# EAGLE design led_driver_12v_1a_round (EAGLE 7.5.0)
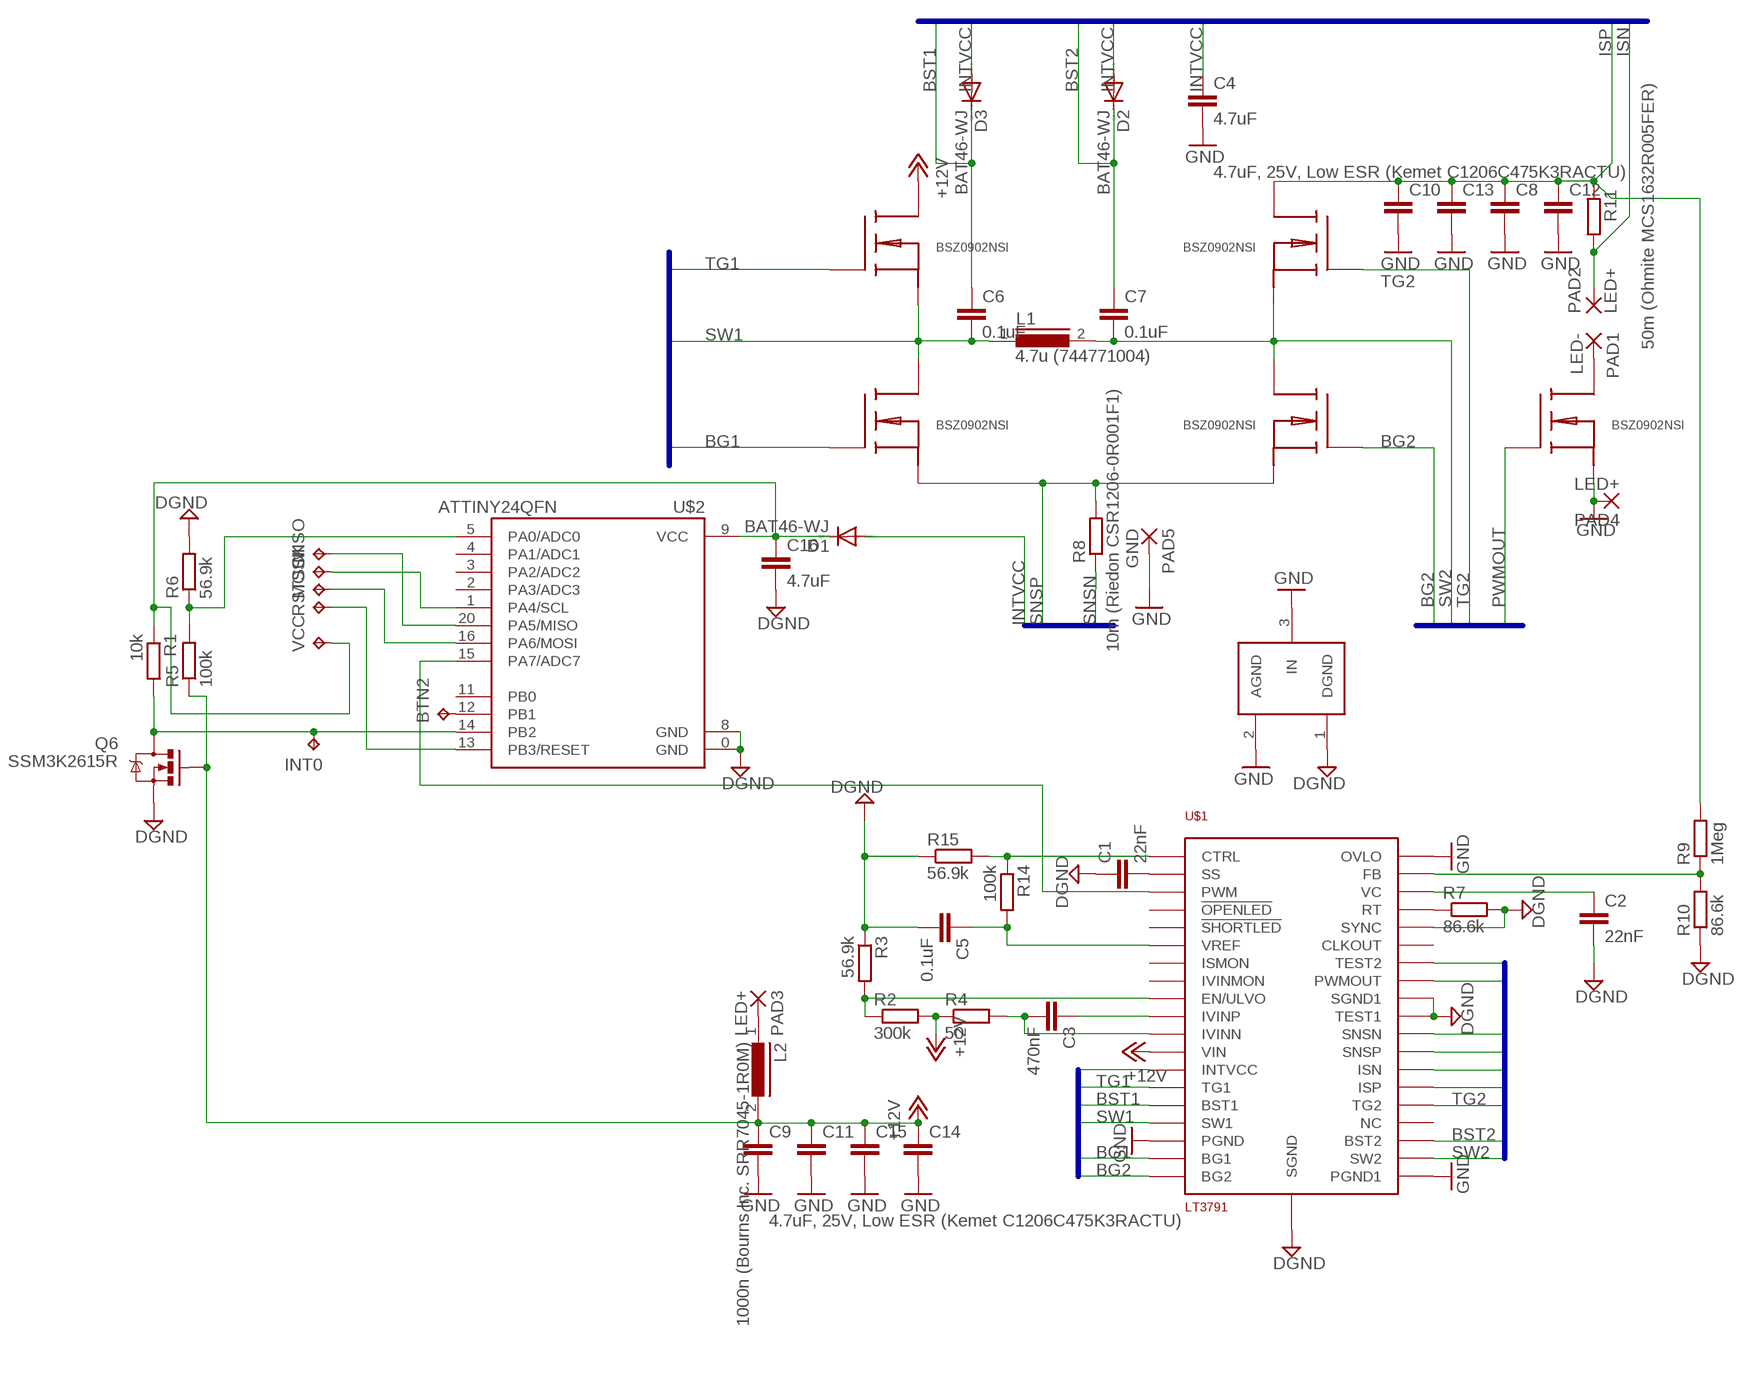
[diagram p0: schematic, sheet 1]

## Parts
BTN2  TPTP20SQ  [TP20SQ]
C1  22nF  C-EUC0402  [C0402]
C2  22nF  C-EUC0402K  [C0402K]
C3  470nF  C-EUC0402K  [C0402K]
C4  4.7uF  C-EUC1206  [C1206]
C5  0.1uF  C-EUC0402K  [C0402K]
C6  0.1uF  C-EUC0402K  [C0402K]
C7  0.1uF  C-EUC0402K  [C0402K]
C8  4.7uF, 25V, Low ESR (Kemet C1206C475K3RACTU)  C-EUC1206  [C1206]
C9  4.7uF, 25V, Low ESR (Kemet C1206C475K3RACTU)  C-EUC1206  [C1206]
C10  4.7uF, 25V, Low ESR (Kemet C1206C475K3RACTU)  C-EUC1206  [C1206]
C11  4.7uF, 25V, Low ESR (Kemet C1206C475K3RACTU)  C-EUC1206  [C1206]
C12  4.7uF, 25V, Low ESR (Kemet C1206C475K3RACTU)  C-EUC1206  [C1206]
C13  4.7uF, 25V, Low ESR (Kemet C1206C475K3RACTU)  C-EUC1206  [C1206]
C14  4.7uF, 25V, Low ESR (Kemet C1206C475K3RACTU)  C-EUC1206  [C1206]
C15  4.7uF, 25V, Low ESR (Kemet C1206C475K3RACTU)  C-EUC1206  [C1206]
C16  4.7uF  C-EUC1206  [C1206]
D1  BAT46-WJ  DIODE-SOD323-W  [SOD323-W]
D2  BAT46-WJ  DIODE-SOD323-W  [SOD323-W]
D3  BAT46-WJ  DIODE-SOD323-W  [SOD323-W]
INT0  TPTP20SQ  [TP20SQ]
L1  4.7u (744771004)  DR127  [DR127]
L2  1000n (Bourns Inc. SRR7045-1R0M)  DR74  [DR74]
MISO  TPTP11R  [TP11R]
MOSI  TPTP11R  [TP11R]
PAD1  LED-  WIREPADSMD5-2,5  [5-2,5]
PAD2  LED+  WIREPADSMD5-2,5  [5-2,5]
PAD3  LED+  WIREPADSMD5-2,5  [5-2,5]
PAD4  LED+  WIREPADSMD5-2,5  [5-2,5]
PAD5  GND  WIREPADSMD1,27-254  [SMD1,27-2,54]
Q1  BSZ0902NSI  BSZ090X  [BSZ090X]
Q2  BSZ0902NSI  BSZ090X  [BSZ090X]
Q3  BSZ0902NSI  BSZ090X  [BSZ090X]
Q4  BSZ0902NSI  BSZ090X  [BSZ090X]
Q5  BSZ0902NSI  BSZ090X  [BSZ090X]
Q6  SSM3K2615R  MOSFET-NCHANNELBSS123LT1G  [SOT23-3]
R1  10k  R-EU_R0402  [R0402]
R2  300k  R-EU_R0402  [R0402]
R3  56.9k  R-EU_R0402  [R0402]
R4  50  R-EU_R0402  [R0402]
R5  100k  R-EU_R0402  [R0402]
R6  56.9k  R-EU_R0402  [R0402]
R7  86.6k  R-EU_R0402  [R0402]
R8  10m (Riedon CSR1206-0R001F1)  R-EU_R1206  [R1206]
R9  1Meg  R-EU_R0402  [R0402]
R10  86.6k  R-EU_R0402  [R0402]
R11  50m (Ohmite MCS1632R005FER)  R-EU_R1206  [R1206]
R14  100k  R-EU_R0402  [R0402]
R15  56.9k  R-EU_R0402  [R0402]
RST  TPTP11R  [TP11R]
SCK  TPTP11R  [TP11R]
U$1  LT3791  [TSSOP38]
U$2  ATTINY24QFN  [QFN20]
U$4  GND_CONNECT  [GND_CONNECT]
VCC  TPTP11R  [TP11R]

## Nets
+12V: C9.1 C11.1 C14.1 C15.1 L2.2 Q1.D Q1.D@1(D) Q1.D@2(D) Q1.D@3(D) Q1.D@4(D) Q6.1(G) R2.2 R4.1 R5.1 U$1.P$12(VIN)
BG1 [HI_PWR]: Q2.G U$1.P$18(BG1)
BG2 [HI_PWR]: Q3.G U$1.P$19(BG2)
BST1 [HI_PWR]: C6.1 D3.C U$1.P$15(BST1)
BST2 [HI_PWR]: C7.1 D2.C U$1.P$22(BST2)
DGND: C1.1 C2.2 C5.2 C16.2 Q6.2(S) R3.1 R6.2 R7.2 R10.1 R15.1 U$1.P$29(TEST1) U$1.P$30(SGND) U$1.P$34(SYNC) U$1.P$39(SGND1) U$2.0(GND) U$2.8(GND) U$4.1(DGND)
GND [HI_PWR]: C4.2 C8.2 C9.2 C10.2 C11.2 C12.2 C13.2 C14.2 C15.2 PAD4.1(P) PAD5.1(P) Q5.S@1(S) Q5.S@2(S) Q5.S@3(S) Q5.S@4(S) U$1.P$17(PGND) U$1.P$20(PGND1) U$1.P$38(OVLO) U$4.2(AGND) U$4.3(IN)
INTVCC [HI_PWR]: C4.1 D1.A D2.A D3.A U$1.P$13(INTVCC) U$1.P$32(TEST2)
ISN: PAD2.1(P) R11.2 U$1.P$26(ISN)
ISP: C8.1 C10.1 C12.1 C13.1 Q4.D Q4.D@1(D) Q4.D@2(D) Q4.D@3(D) Q4.D@4(D) R9.2 R11.1 U$1.P$25(ISP)
N$1: C5.1 R14.2 U$1.P$6(VREF)
N$2: R14.1 R15.2 U$1.P$1(CTRL)
N$3: R7.1 U$1.P$35(RT)
N$4: C1.2 U$1.P$2(SS)
N$5: C2.1 U$1.P$36(VC)
N$6: R9.1 R10.2 U$1.P$37(FB)
N$7: C3.1 U$1.P$10(IVINP)
N$8: BTN2.TP U$2.12(PB1)
N$9: C3.2 R4.2 U$1.P$11(IVINN)
N$11: R2.1 R3.2 U$1.P$9(EN/ULVO)
N$12: C16.1 D1.C R1.1 U$2.9(VCC) VCC.TP
N$13: INT0.TP Q6.3(D) R1.2 U$2.14(PB2)
N$14: U$1.P$3(PWM) U$2.15(PA7/ADC7)
N$15: R5.2 R6.1 U$2.5(PA0/ADC0)
N$16: MISO.TP U$2.20(PA5/MISO)
N$17: MOSI.TP U$2.16(PA6/MOSI)
N$18: RST.TP U$2.13(PB3/RESET)
N$19: PAD1.1(P) Q5.D Q5.D@1(D) Q5.D@2(D) Q5.D@3(D) Q5.D@4(D)
N$20: SCK.TP U$2.1(PA4/SCL)
N$21: L2.1 PAD3.1(P)
PWMOUT [HI_PWR]: Q5.G U$1.P$31(PWMOUT)
SNSN: R8.1 U$1.P$28(SNSN)
SNSP: Q2.S@1(S) Q2.S@2(S) Q2.S@3(S) Q2.S@4(S) Q3.S@1(S) Q3.S@2(S) Q3.S@3(S) Q3.S@4(S) R8.2 U$1.P$27(SNSP)
SW1 [HI_PWR]: C6.2 L1.1 Q1.S@1(S) Q1.S@2(S) Q1.S@3(S) Q1.S@4(S) Q2.D Q2.D@1(D) Q2.D@2(D) Q2.D@3(D) Q2.D@4(D) U$1.P$16(SW1)
SW2 [HI_PWR]: C7.2 L1.2 Q3.D Q3.D@1(D) Q3.D@2(D) Q3.D@3(D) Q3.D@4(D) Q4.S@1(S) Q4.S@2(S) Q4.S@3(S) Q4.S@4(S) U$1.P$21(SW2)
TG1 [HI_PWR]: Q1.G U$1.P$14(TG1)
TG2 [HI_PWR]: Q4.G U$1.P$24(TG2)
Unconnected: U$1.P$4(!OPENLED) U$1.P$5(!SHORTLED) U$1.P$7(ISMON) U$1.P$8(IVINMON) U$1.P$23(NC) U$1.P$33(CLKOUT) U$2.2(PA3/ADC3) U$2.3(PA2/ADC2) U$2.4(PA1/ADC1) U$2.11(PB0)

## Buses
BG1,BG2,SW1,SW2,TG1,TG2,BST1,BST2,INTVCC
BG1,BG2,SW1,SW2,TG1,TG2,BST1,BST2,INTVCC,PWMOUT,SNSP,SNSN,ISN,ISP

## Library data of the parts
BTN2 INT0 MISO MOSI RST SCK VCC = testpad:TP: Test pad
C1-C3 C5-C7 = resistor:C-EU: CAPACITOR, European symbol
C4 C8-C16 = rcl:C-EU: CAPACITOR, European symbol
D1-D3 = diode:DIODE-: DIODE
L1 = inductors:DR127: High Power Density, High Efficiency, Shielded Inductors Source: coiltronics_dr_series.pdf
L2 = inductors:DR74: High Power Density, High Efficiency, Shielded Inductors Source: coiltronics_dr_series.pdf
PAD1-PAD5 = wirepad:WIREPAD: Wire PAD connect wire on PCB
Q1-Q5 = vsd_custom:BSZ090X
Q6 = SparkFun-DiscreteSemi:MOSFET-NCHANNEL: Common NMOSFET Parts MFG P/N Store ID Prod ID FDD8780 TRANS-09984 SI7820DN TRANS-11055 FDS6630A IC-08089 2N7002PW TRANS-11151 FQP30N06L COM-10213 TRANS-10060 BSS123LT1G TRANS-08345 BSS138 TRANS-00830 BS170 2N7000; PROD_ID: TRANS-08345
R1-R11 R14 R15 = resistor:R-EU_: RESISTOR, European symbol
U$1 = ltc3791:LT3791
U$2 = SparkFun-DigitalIC:ATTINY24: Atmel 20-pin 2kB flash uC
U$4 = SparkFun-Passives:GND_CONNECT: Use to make a connection of multiple grounds in only one place.

## Net classes
0 default: width 0.152 mm, clearance 0.152 mm
1 HI_PWR: width 0.3 mm, drill 0.4 mm, clearance 0.15 mm

## Board
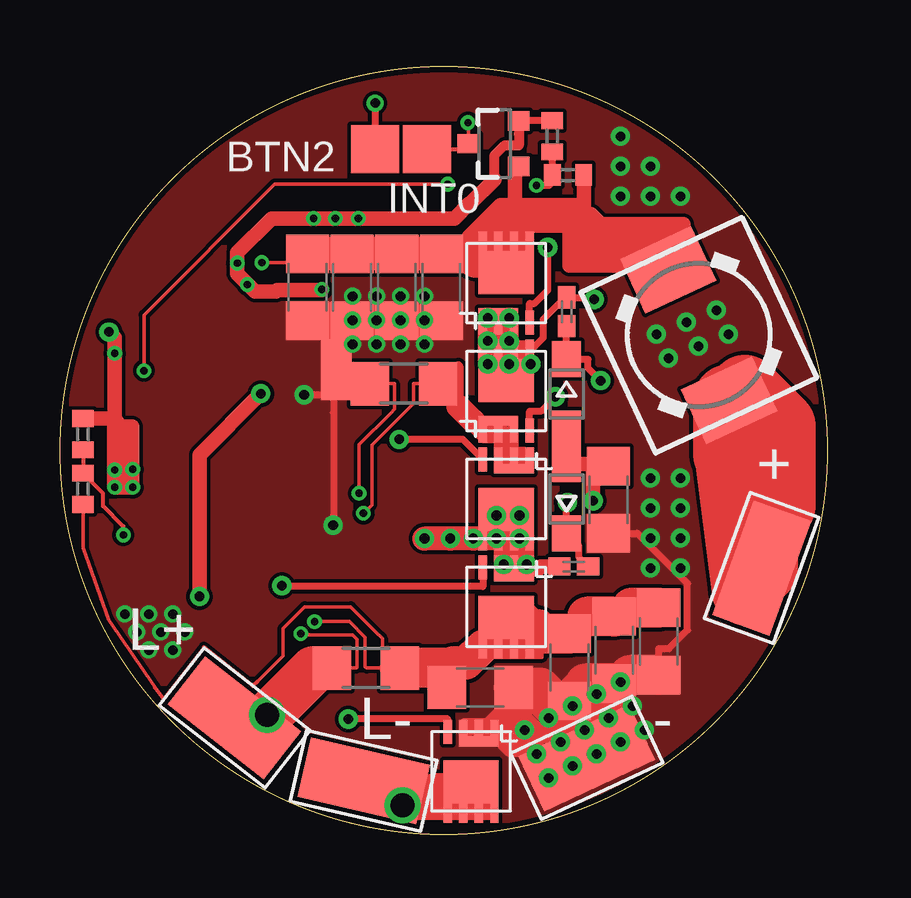
[diagram p1: board, top side]
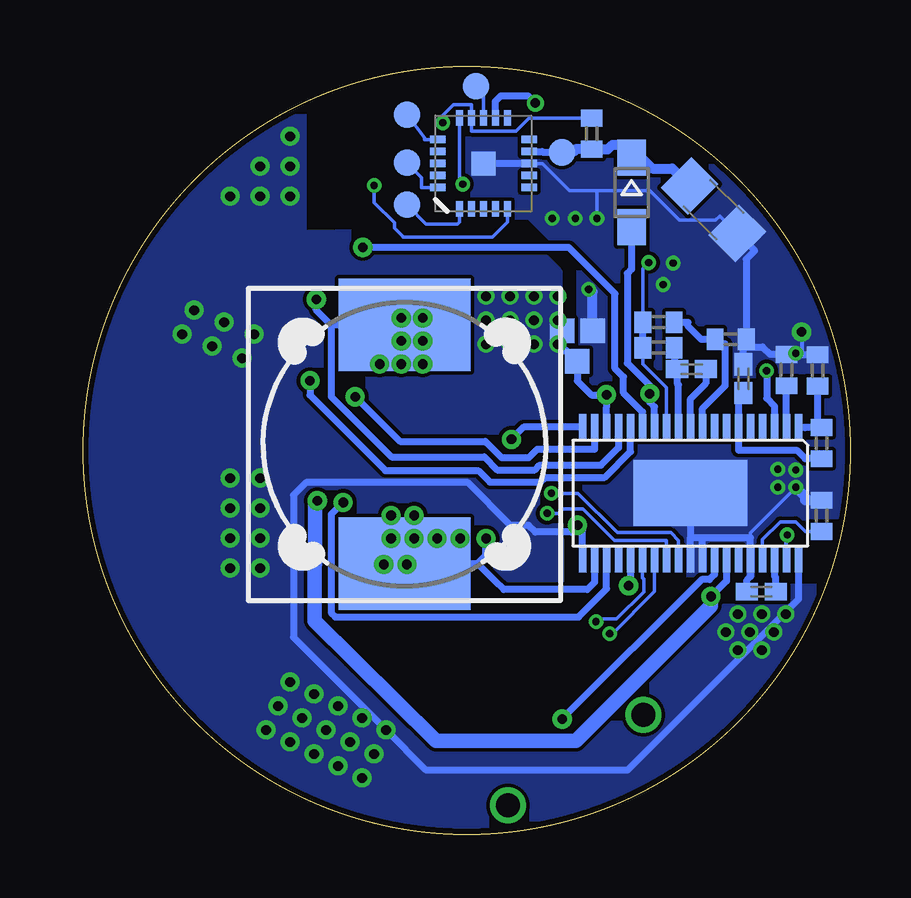
[diagram p2: board, bottom side, seen from below]

Size 32 x 32 mm. Coordinates in mm from the lower left corner, seen from the top.
Outline: circle at 16,16 radius 16
Copper layers (1*16): Top 0.035mm / dielectric 1.5mm / Bottom 0.035mm
Design rules "SeeedStudio_2layer_DRU_no_angle_20140221": minimum track width 6mil, minimum drill 12mil, track to track 6mil, track to pad 6mil, pad to pad 6mil, via to via 6mil, smd to smd 0mil, copper to edge 10mil, drill to drill 10mil, minimum pad ring 10mil, minimum via ring 6mil, stop-mask expansion 2mil, vias tented up to drill 100mil, thermal gap 10mil

### Footprints (pad centres in the part's own frame; a part is rotated, then mirrored left to right if it is on the bottom)
TP20SQ = smd 2 x 2: TP 0,0
C0402 = smd 0.7 x 0.9: 1 -0.65,0; 2 0.65,0
C0402K = smd 0.925 x 0.74: 1 -0.6,0; 2 0.6,0
C1206 = smd 1.6 x 1.8: 1 -1.4,0; 2 1.4,0
SOD323-W = smd 1.5 x 1.2: A 1.45,0; C -1.45,0
DR127 = smd 3.85 x 5.5: 1 -4.975,0; 2 4.975,0
DR74 = smd 2.5 x 3.25: 1 -3,0; 2 3,0
TP11R = smd 1.1 x 1.1: TP 0,0
5-2,5 = smd 2.54 x 5.08: 1 0,0
SMD1,27-2,54 = smd 1.27 x 2.54: 1 0,0
BSZ090X = smd 1.8 x 2.3: D 0.44,0 | smd 1 x 0.35: D@1 1.65,-0.975; D@2 1.65,-0.325; D@3 1.65,0.325; D@4 1.65,0.975; G -1.65,-0.975; S@2 -1.65,-0.325; S@3 -1.65,0.325; S@4 -1.65,0.975 | smd 0.4 x 1.65: S@1 -1.25,0.325
SOT23-3 = smd 0.8 x 0.9: 1 -0.95,-1; 2 0.95,-1; 3 0,1.1
R0402 = smd 0.7 x 0.9: 1 -0.65,0; 2 0.65,0
R1206 = smd 1.6 x 1.803: 1 -1.422,0; 2 1.422,0
TSSOP38 = smd 1.1 x 0.315: P$1 -2.75,4.5; P$2 -2.75,4; P$3 -2.75,3.5; P$4 -2.75,3; P$5 -2.75,2.5; P$6 -2.75,2; P$7 -2.75,1.5; P$8 -2.75,1; P$9 -2.75,0.5; P$10 -2.75,0; P$11 -2.75,-0.5; P$12 -2.75,-1; P$13 -2.75,-1.5; P$14 -2.75,-2; P$15 -2.75,-2.5; P$16 -2.75,-3; P$17 -2.75,-3.5; P$18 -2.75,-4; P$19 -2.75,-4.5; P$20 2.75,-4.5; P$21 2.75,-4; P$22 2.75,-3.5; P$23 2.75,-3; P$24 2.75,-2.5; P$25 2.75,-2; P$26 2.75,-1.5; P$27 2.75,-1; P$28 2.75,-0.5; P$29 2.75,0; P$30 2.75,0.5; P$31 2.75,1; P$32 2.75,1.5; P$33 2.75,2; P$34 2.75,2.5; P$35 2.75,3; P$36 2.75,3.5; P$37 2.75,4; P$38 2.75,4.5 | smd 2.75 x 4.75: P$39 0,0
QFN20 = smd 1 x 1: 0 0,0 | smd 0.65 x 0.3: 1 -1.9,1; 2 -1.9,0.5; 3 -1.9,0; 4 -1.9,-0.5; 5 -1.9,-1; 11 1.9,-1; 12 1.9,-0.5; 13 1.9,0; 14 1.9,0.5; 15 1.9,1 | smd 0.3 x 0.65: 6 -1,-1.9; 7 -0.5,-1.9; 8 0,-1.9; 9 0.5,-1.9; 10 1,-1.9; 16 1,1.9; 17 0.5,1.9; 18 0,1.9; 19 -0.5,1.9; 20 -1,1.9
GND_CONNECT = smd 1.016 x 1.016: 1 -1.016,0; 2 -1.016,-1.27; 3 0.254,-0.635

### Placement (x,y rotation side)
BTN2  13.14,28.56 90 top
C1  2.67,19.35 270 bottom
C2  3.72,10.12 180 bottom
C3  6.63,19.39 180 bottom
C4  22.87,13.95 270 top
C5  4.47,19 90 bottom
C6  21.12,21.78 90 top
C7  21.42,11.16 180 top
C8  21.24,6.96 270 top
C9  10.32,22.8 270 top
C10  24.96,8.04 270 top
C11  12.18,22.8 270 top
C12  17.52,6.12 0 top
C13  23.1,7.68 270 top
C14  15.9,22.8 270 top
C15  14.04,22.8 270 top
C16  5.71,26.04 315 bottom
D1  9.13,26.75 270 bottom
D2  21.12,13.98 90 top
D3  21.12,18.36 270 top
INT0  15.3,28.56 0 top
L1  18.6,16.26 270 bottom
L2  26.63,20.81 115 top
MISO  18.5,28 270 bottom
MOSI  18.5,30 270 bottom
PAD1  12.66,2.23 77 top
PAD2  7.28,4.86 52 top
PAD3  29.26,11.1 160 top
PAD4  21.96,3.18 115 top
PAD5  11.52,19.38 0 top
Q1  18.6,22.98 90 top
Q2  18.6,18.48 90 top
Q3  18.6,13.98 270 top
Q4  18.6,9.48 270 top
Q5  17.14,2.62 270 top
Q6  18.13,28.79 90 top
R1  10.79,29.2 90 bottom
R2  8.01,21.35 180 bottom
R3  5,20.63 180 bottom
R4  8.01,20.29 0 bottom
R5  21.18,27.48 180 top
R6  20.52,29.1 90 top
R7  1.21,13.28 90 bottom
R8  14.34,18.78 0 top
R9  0.96,14.4 270 top
R10  0.96,16.68 270 top
R11  12.75,6.93 180 top
R14  1.21,16.3 270 bottom
R15  1.38,19.34 270 bottom
RST  15.61,31.18 270 bottom
SCK  18.5,26.25 270 bottom
U$1  6.67,14.22 270 bottom
U$2  15.3,27.96 90 bottom
U$4  10.76,19.96 270 bottom
VCC  12.04,28.43 270 bottom

### Tracks (layer width: path | path; a pad name or v marks a point on that pad's centre or on a via)
+12V  (via drill 0.3 pad 0.61)
  Top 0.152: 15.17,24.2 C14.1 | 18.27,24.27 18.27,23.9 18.27,23.75 Q1.D | Q1.D@3 18.27,24.27 | 17.62,24.27 17.62,23.9 | Q1.D@4 17.62,24.27 | 17.62,24.27 18.27,24.27 | 10.32,23.69 10.54,23.69 11.05,24.2 | 10.32,23.69 10.26,23.83 v8.41,23.83 | C9.1 10.32,23.69
  Top 0.3: Q1.D@2 Q1.D@1
  Top 0.6: Q6.1 18.96,27.6 18.96,26.16 18.6,25.8 18.6,25.2 18.66,25.26 18.66,25.86 17.76,24.96 17.1,24.96 18.36,26.22 18.93,26.22 | 18.93,26.22 Q1.D@2 19.26,24.63 19.26,24.54 17.04,24.54 17.04,24.9 19.32,24.9 19.32,25.38 21.96,25.38 21.96,25.2 21.78,24.12 21.24,25.2 21.24,23.7 25.98,23.7 25.98,25.44 22.56,25.44 22.14,25.86 22.14,24.72 22.86,24 22.86,24.9 22.98,25.02 23.04,25.02 23.76,24.3 24.24,24.3 23.28,25.02 25.62,25.08 22.26,24.18 22.2,25.44 19.74,25.44 Q1.D@3 | R5.1 21.84,26.81 21.84,25.62 | 21.84,25.62 21.6,26.22 19.38,26.22 19.38,25.74 21.66,25.74 21.66,26.22 18.93,26.22 | 21.84,25.62 23.93,23.53 L2.2
  Top 1.4: C14.1 16.79,24.2 17.33,23.9 17.62,23.9 | 15.17,24.2 C15.1 C11.1 11.05,24.2
  Bottom 0.152: R4.1 8.65,19.61 7.67,18.63 7.67,17.75 U$1.P$12 | v8.41,23.83 8.65,23.59 R2.2
  Bottom 0.3: R4.1 R2.2
BG1  (via drill 0.4 pad 0.8)
  Top 0.3: v20.65,18.24 20.05,17.63 19.57,17.63 Q2.G
  Bottom 0.3: v20.65,18.24 20.64,18.24 18.78,16.38 15.24,16.38 15.18,16.32 15.16,16.32 14.55,15.7 13.41,15.7 13.05,16.06 10.68,16.06 U$1.P$18
BG2  (via drill 0.4 pad 0.8)
  Top 0.3: Q3.G 16.79,16.46 v14.14,16.46
  Bottom 0.3: U$1.P$19 13.63,16.97 v14.14,16.46
BST1  (via drill 0.4 pad 0.8)
  Top 0.3: v22.54,18.91 22.02,19.43 22.02,19.81 D3.C 21.12,20.86 C6.1
  Bottom 0.3: v22.54,18.91 22.54,18.31 19.39,15.16 15.52,15.16 15.04,14.68 12.92,14.68 12.72,14.88 10.25,14.88 9.18,15.95 U$1.P$15
BST2  (via drill 0.4 pad 0.8)
  Top 0.3: v21.16,13.83 21.16,13.62 21.12,13.58 D2.C 21.62,12.03 21.62,11.56 C7.1
  Bottom 0.3: v21.16,13.83 21.65,13.34 21.65,9.23 21.48,9.06 11.35,9.06 10.18,10.23 U$1.P$22
DGND  (via drill 0.3 pad 0.61, 0.4 pad 0.8)
  Top 0.152: v10.92,22.72 10.9,22.7
  Top 0.16: 2.27,17.33 2.28,17.34 | 8.81,25.67 8.83,25.67
  Top 0.3: R6.2 Q6.2
  Top 0.406: 9.06,22.68 9,22.62 | 8.13,22.62 8.12,22.64 | 18.12,27.3 18.12,28.32 18.54,28.72 19.13,28.72 19.13,29.2 Q6.2
  Top 0.6: 10.9,22.7 10.86,22.68 9.06,22.68 | 9,22.62 8.13,22.62 | 8.83,25.67 v10.57,25.67 16.45,25.67 17.06,26.28 17.1,26.28 18.12,27.3 | 8.12,22.64 7.39,23.36 7.39,24.25 8.81,25.67 | v2.28,14.46 2.96,14.46 3,14.5 3,17 2.5,17 | 2.5,17 2.25,17.25 2.25,14.5 2.5,14.5 2.75,14.75 2.75,16.75 2.5,17 | 2.5,17 2.28,17.34 2.28,20.7 v2.04,20.94 | R10.1 2.27,17.33
  Bottom 0.152: 4.17,12.37 4.17,12.57 v2.28,14.46 | 10.57,26.82 v10.57,25.67 | 10.57,26.82 11.71,26.82 12.85,27.96 U$2.8 | 10.57,26.82 | 10.57,26.82 8.38,26.82 7.15,25.6 5.63,25.6 5.45,25.78 C16.2 4.71,25.03 | R3.1 4.35,20.32 4.38,20.29 4.47,20.29 | 6.17,11.53 U$1.P$30
  Bottom 0.16: v2.04,20.94 2.04,20.12 2.16,20
  Bottom 0.3: 6.17,12.37 4.17,12.37 U$1.P$34 4.17,10.74 4.32,10.59 C2.2 | 6.67,12.37 6.17,12.37 | U$1.P$39 6.67,12.37 | C5.2 4.47,20.29 | 4.35,20.32 3.67,20.32 3.35,20 C1.1 2.16,20 2,20 1.98,19.98 R15.1 | 4.71,25.03 4,24.32 4.35,23.97 R3.1 | 6.17,11.53 6.17,12.37 | U$1.P$29 6.67,12.37 | U$2.8 U$2.0
  Bottom 0.406: R7.2 1.89,13.93 1.89,14.07 v2.28,14.46 | U$4.1 10.76,22.61 v10.92,22.72
  other vias: 7.39,23.81 11.47,25.67 12.43,25.67 7.81,22.91 2.28,15.19 2.28,20.05 3.03,14.47 3.03,15.22
  pour Bottom (no thermals): 0.12,10.86 11.4,10.86 11.34,10.92 11.34,17.94 11.28,18 11.28,23.64 13.38,25.74 21.72,25.74 21.72,35.4 10.84,35.4 0.84,25.4 0.84,24.66 0.12,23.94
GND  (via drill 0.4 pad 0.41, 0.4 pad 0.8)
  Top 0.3: v11.38,12.88 11.4,12.89 11.4,17.57 11.4,18.31 | 21.9,6.22 21.9,6.28 | 20.86,5.54 21.22,5.54 C8.2 | C13.2 23.4,6.28 23.76,6.64 | C4.2 24.07,12.54 26.16,10.45 26.16,8.51 25.39,7.74 24.96,7.74 C10.2 | 18.92,4.92 v19.37,4.35 | Q5.S@2 16.82,4.62 17.04,4.39 17.04,4.08 17.28,3.84 18.24,3.84 18.72,3.36 19.14,3.36 19.98,3.36 20.58,3.96 20.58,4.32 19.74,5.16 18.24,5.16 17.76,4.68 16.8,4.68 18.9,4.68 19.14,4.92 19.56,4.92 20.34,4.14 19.86,3.66 18.72,3.66 18.36,4.02 17.52,4.02 17.16,4.38 17.16,4.5 19.2,4.5 19.38,4.68 19.44,4.68 19.98,4.14 19.92,4.14 19.68,3.9 18.72,3.9 18.36,4.26 17.64,4.26 19.2,4.26 19.38,4.44 19.38,4.38 19.62,4.14 18.72,4.14 17.46,4.62 Q5.S@3 | 18.11,4.67 18.36,4.92 18.92,4.92 | Q5.S@3 Q5.S@1 Q5.S@3 | Q5.S@3 17.45,4.67 18.11,4.67 | C9.2 10.56,22.04 11.27,22.04 11.4,19.93 | 11.4,19.93 11.4,20.71 11.49,20.71 C11.2 12.84,21.4 | 11.4,19.93 PAD5.1 11.4,19.05 11.4,18.31 | C12.2 18.92,4.92 | 20.86,5.54 20.6,5.54 | 20.86,5.54 | Q5.S@4 18.11,4.67 | 11.4,18.31 v10.18,18.31 v10.18,18.32
  Top 1.4: 12.84,21.4 C15.2 C14.2
  Top 1.676: C8.2 21.9,6.22 | C13.2 21.9,6.28 | C10.2 23.76,6.64 | C12.2 20.02,6.12 20.6,5.54 | PAD4.1 21.06,3.18 21.06,4.26 23.16,4.26 23.16,5.7 20.86,5.54
  Bottom 0.3: U$1.P$38 2.17,9.8 9.3,2.67 17.69,2.67 v19.37,4.35 23.23,8.21 23.23,14.14 22.71,14.66 15.96,14.66 14.18,12.88 13.42,12.88 13.14,12.6 11.64,12.6 11.4,12.84 v11.38,12.88 11.18,12.67 11.18,11.89 U$1.P$20 | U$1.P$17 10.18,17.82 v10.18,18.32 10.8,18.32 11.39,18.9 U$4.3 11.85,20.17 12.03,20.17 U$4.2
  other vias: 2.7,9.18 3.7,9.18 4.7,9.18 3.2,8.43 4.2,8.43 5.2,8.43 3.7,7.68 4.7,7.68 12.2,20.43 13.2,20.43 14.2,20.43 15.2,20.43 15.2,21.43 14.2,21.43 13.2,21.43 12.2,21.43 12.2,22.43 13.2,22.43 14.2,22.43 15.2,22.43 19.87,3.35 20.37,2.35 21.37,2.85 20.87,3.85 20.37,4.85 21.37,5.35 21.87,4.35 22.37,3.35 23.37,3.85 22.87,4.85 22.37,5.85 23.37,6.35 23.87,5.35 24.37,4.35 23.37,29.1 23.37,27.85 23.37,26.6 24.62,27.85 24.62,26.6 25.87,26.6 24.62,11.1 24.62,12.35 24.62,13.6 24.62,14.85 25.87,14.85 25.87,13.6 25.87,12.35 25.87,11.1 24.87,20.85 26.12,21.35 27.37,21.85 27.87,20.85 26.62,20.35 25.37,19.85
  pour Bottom (no thermals): 0.3,10.14 12.24,10.14 12.3,23.4 13.92,25.02 22.98,24.9 22.98,30.18 24.84,30.66 28.26,30.9 34.26,10.44 23.34,-0.48 8.94,-0.48 0.3,8.16
  pour Top (no thermals): -0.42,33.6 32.28,33.6 32.28,-1.44 -0.42,-1.44
INTVCC  (via drill 0.4 pad 0.8)
  Top 0.3: 22.02,15.43 22.11,15.35 22.23,15.35 22.27,15.35 C4.1 | D3.A 21.12,15.86 21.14,15.86 21.57,15.43 D2.A
  Top 0.6: v22.23,13.9 22.23,15.35 | v5.82,9.91 5.82,15.82 v8.37,18.37 | 21.57,15.43 22.02,15.43
  Bottom 0.3: U$1.P$32 5.17,10.56 v5.82,9.91 | U$1.P$13 8.18,17.82 8.37,18.02 v8.37,18.37 8.37,18.7 9.31,19.64 9.31,23.38 9.13,23.56 9.13,25.25 D1.A
  Bottom 0.6: v5.82,9.91 5.82,9.53 11.45,3.9 17.28,3.9 22.35,8.9 22.32,13.44 22.32,13.81 v22.23,13.9
ISN  (via drill 0.3 pad 0.61, 1)
  Top 0.152: R11.2 12.36,6.93 12.39,6.97 12.39,8.12 12.2,8.31 10.09,8.31 v10.04,8.36
  Top 0.406: v8.64,4.98 8.54,4.98 7.95,4.38
  Top 1: R11.2 10.65,6.93 10.56,6.84
  Top 2: PAD2.1 7.95,4.38 8.04,4.32 10.56,6.84
  Bottom 0.152: v10.04,8.36 9.94,8.36 8.18,10.12 8.18,10.69 U$1.P$26 | v10.04,8.36
ISP  (via drill 0.3 pad 0.61)
  Top 0.152: v10.61,8.87 12.08,8.87 12.73,8.21 12.73,6.99 12.78,6.93 R11.1 | Q4.D 19.09,9.04 | 19.91,8.56 19.57,8.56 Q4.D@4 Q4.D@3 Q4.D@2 18.27,8.16 20.1,8.16 20.1,7.38 18.06,7.38 18.06,7.5 19.98,7.5 19.98,8.04 18.42,8.04 18.42,7.62 19.8,7.62 19.8,7.92 18.48,7.92 18.48,7.74 19.44,7.74 Q4.D@1 | C8.1 21.25,8.36 21.97,9.08 | C13.1 23.47,9.08 23.83,9.44 | C12.1 16.12,6.93 16.26,6.93 16.38,7.05 16.38,7.14 16.02,7.5 13.5,7.5 13.44,7.56 13.44,8.16 13.32,8.28 13.26,8.34 12.12,9.48 10.2,9.48 9.3,8.58 9.3,7.44 8.22,6.36 | R9.2 0.96,11.94 2.04,8.94 3.96,6.12
  Top 0.16: 8.22,6.36 8.04,6.18 6,7.8 4.32,5.64 3.96,6.12
  Top 1.4: Q4.D@1 16.93,7.14 16.38,7.14
  Top 1.676: 19.09,9.04 19.57,8.56 | C8.1 20.11,8.36 19.91,8.56 | C13.1 21.97,9.08 | 16.12,6.93 R11.1 | C10.1 23.83,9.44
  Bottom 0.152: v10.61,8.87 10.51,8.97 9.76,8.97 8.62,10.11 8.62,10.64 8.68,10.69 U$1.P$25
N$1
  Bottom 0.152: C5.1 4.67,18.19
  Bottom 0.3: R14.2 1.89,15.65 2.25,16.01 4.67,16.01 U$1.P$6 4.67,18.19
N$2
  Bottom 0.152: R14.1 1.38,16.95
  Bottom 0.3: R15.2 1.38,16.95 1.89,16.95 1.9,16.97 U$1.P$1
N$3
  Bottom 0.152: R7.1 1.89,12.62 2.29,13.02 2.93,13.02 3.67,12.28 3.67,12.25 U$1.P$35
N$4
  Bottom 0.3: U$1.P$2 C1.2
N$5
  Bottom 0.3: C2.1 3.12,10.71 3.17,10.77 U$1.P$36
N$6  (via drill 0.3)
  Top 0.16: R10.2 R9.1 1.8,14.21 1.8,13.68 2.64,12.84 v2.64,12.48
  Bottom 0.16: U$1.P$37 2.67,12.45 v2.64,12.48
N$7
  Bottom 0.3: C3.1 6.04,18.79 6.67,18.15 U$1.P$10
N$8  (via drill 0.4)
  Top 0.3: v13.14,30.48 BTN2.TP
  Bottom 0.3: U$2.12 14.8,30.55 14.58,30.78 13.44,30.78 v13.14,30.48
N$9
  Bottom 0.152: 7.36,19.61 7.24,19.49 C3.2
  Bottom 0.3: C3.2 7.24,18.79 7.17,18.73 U$1.P$11 | R4.2 7.36,19.61
N$11
  Bottom 0.3: U$1.P$9 6.17,17.75 5.22,18.7 5.22,20.44 R3.2 6.23,20.63 6.78,21.18 6.78,21.35 R2.1
N$12
  Bottom 0.152: D1.C 9.26,28.75 | 7.43,27.76
  Bottom 0.3: U$2.9 12.85,28.46 12.81,28.43 VCC.TP 11.6,28.43 | C16.1
  Bottom 0.406: 11.6,28.43 11.47,28.55 R1.1 10.12,28.55 9.93,28.75 9.26,28.75 8.27,27.76 7.43,27.76 C16.1
N$13  (via drill 0.3 pad 0.61)
  Top 0.152: Q6.3 17.03,29.64 v17.01,29.66
  Top 0.16: INT0.TP 16.8,28.56 Q6.3
  Bottom 0.152: R1.2 13.41,29.86 13.96,29.31 15.8,29.31 U$2.14 15.8,29.93 15.8,30.42 16.55,30.42 17.01,29.96 v17.01,29.66
N$14  (via drill 0.3 pad 0.61)
  Top 0.152: v16.17,27.1 8.96,27.1 3.5,21.65 v3.5,19.33
  Bottom 0.152: U$2.15 16.3,27.24 v16.17,27.1
  Bottom 0.3: v3.5,19.33 3.5,18.18 3.17,17.85 U$1.P$3
N$15  (via drill 0.3 pad 0.61)
  Top 0.3: R6.1 R5.2 20.53,27.18 20.4,27.06 19.92,27.06 v19.86,27.06 19.81,27.01 v19.86,27.05
  Bottom 0.152: U$2.5 14.3,25.51 14.93,24.89 18.66,24.89 18.66,24.91 19.02,25.26 19.02,25.5 19.86,26.34 v19.86,27.05
N$16
  Bottom 0.152: U$2.20 17.89,26.96 17.89,27.36 18.48,27.96 MISO.TP
N$17
  Bottom 0.152: U$2.16 17.76,28.96 17.76,29.04 MOSI.TP
N$18
  Bottom 0.152: U$2.13 15.3,30.99 RST.TP
N$19  (via drill 1)
  Top 0.152: 16.16,1.7 Q5.D@1 Q5.D@2 17.14,0.97 | 17.14,0.97 Q5.D@3 17.7,1.14 17.7,1.02 17.28,1.02 17.28,1.2 17.82,1.2 17.82,0.96 17.04,0.96 17.04,1.26 17.94,1.26 17.94,0.9 14.52,0.9 14.52,0.72 18,0.72 18,0.84 14.4,0.84 14.4,0.66 18.12,0.66 Q5.D@4 | 17.14,0.97 Q5.D | 15.42,1.52
  Top 0.406: v14.28,1.2 14.28,0.96 14.4,0.84
  Top 1.676: PAD1.1 15.42,1.52 15.61,1.7 16.16,1.7
N$20
  Bottom 0.152: U$2.1 16.3,25.51 16.39,25.43 17.69,25.43 18.48,26.22 SCK.TP
N$21
  Top 2.9: 27.9,15.84 28.62,10.14 28.62,13.68 28.56,18.54 30.06,17.04 30.06,13.68 29.26,12.88
  Top 3: L2.1 27.9,15.84 | 29.26,12.88 PAD3.1
PWMOUT  (via drill 0.4 pad 0.8)
  Top 0.3: Q5.G 16.18,4.8 v12.02,4.8
  Bottom 0.3: U$1.P$31 5.67,10.83 5.89,10.62 6.21,10.62 v12.02,4.8
SNSN  (via drill 0.3 pad 0.61)
  Top 0.152: v12.47,14.21 12.47,16.24 13.77,17.54 13.95,17.72 13.95,18.78 R8.1
  Bottom 0.152: v12.47,14.21 11.37,14.21 9.73,12.57 7.5,12.57 7.17,12.25 U$1.P$28
SNSP  (via drill 0.3 pad 0.61)
  Top 0.152: v12.65,13.38 13,13.73 13,16.22 14.73,17.95 14.73,18.78 R8.2 | Q3.S@4 19.57,15.26 19.38,15.26 19.38,16.08 19.14,16.08 19.14,15.42 19.26,15.42 19.26,15.96 18.93,15.26 | 18.93,15.26 Q3.S@1 18.93,15.26 | Q3.S@3 18.93,15.26 | Q3.S@2 18.27,15.26 18.48,15.48 | 18.48,15.48 18.6,15.48 18.6,16.98 18.48,16.98 17.1,16.98 17.1,16.86 18.54,16.86 18.54,16.74 17.22,16.74 17.34,16.62 18.48,16.62 18.42,16.56 17.4,16.56 17.46,16.5 18.48,16.5 18.42,16.44 17.58,16.44 17.64,16.38 18.48,16.38 18.48,15.48 | 18.48,15.48 18.72,15.48 18.72,16.98 18.93,16.98 18.93,15.26 | Q2.S@3 18.27,17.04 Q2.S@1 18.27,17.26 17.62,17.26 Q2.S@4
  Top 0.406: Q2.S@1 17.22,17.23 | 16.61,17.84 16.61,19.5 R8.2 | Q2.S@2 18.93,16.36 Q3.S@3 | Q2.S@3 Q3.S@2
  Top 1: 16.61,17.84 17.22,17.23
  Bottom 0.152: U$1.P$27 7.67,11.86 7.67,12.25 9.85,12.25 11.15,13.56 12,13.56 12.18,13.38 v12.65,13.38
SW1  (via drill 0.4 pad 0.8)
  Top 0.3: 18.93,20.93 Q1.S@2 v18.73,21.52 | 18.27,20.93 18.93,20.93 | 18.27,20.93 Q1.S@3 Q1.S@1 18.27,21.78 17.93,21.77 17.62,21.77 18.12,20.88 18.12,20.46 18.48,20.46 18.48,20.94 17.94,20.94 17.94,20.52 | Q2.D 18.6,20.12 18.93,20.44 | 18.93,20.44 18.93,20.93 | Q2.D@2 18.93,20.44 | 18.27,20.93 Q2.D@3 Q2.D@4 17.62,19.81 v17.83,19.6 | v22.27,22.3 21.87,22.3 21.79,22.38 C6.2 21.06,22.38 20.15,21.47 20.15,20.7 Q2.D@1 | Q2.D@2 Q2.D@1 | 18.66,20.58 18.66,21.12 17.76,21.12 17.76,19.98 19.32,19.98 19.32,20.34 18.9,20.34 18.9,21.3 17.58,21.3 17.58,19.74 19.56,19.74 19.56,20.46 18.96,20.46 18.96,21.48 17.64,21.48 17.64,21.33 Q1.S@4 17.64,21.33 v17.83,21.52 | 18.66,20.58 18.66,20.22 17.94,20.22 17.94,20.52 | v17.83,20.56 17.88,20.52 17.94,20.52 | v18.73,20.56 18.72,20.58 18.66,20.58 | v18.73,19.6 18.93,19.8 Q2.D@2 | v19.63,19.6 19.57,19.66 Q2.D@1
  Bottom 0.3: 21.65,21.23 21.65,18.24 19.14,15.73 15.27,15.73 14.73,15.19 13.17,15.19 12.97,15.39 10.4,15.39 9.68,16.12 U$1.P$16 | 21.65,21.23 22.27,21.86 v22.27,22.3 | L1.1 21.65,21.23
SW2  (via drill 0.4 pad 0.8)
  Top 0.3: Q3.D@4 v19.16,12.33 | v19.16,12.33 Q3.D@3 18.91,12.34 18.6,12.34 | 18.44,11.93 18.44,12.33 18.45,12.34 18.6,12.34 | 18.44,11.93 18.27,11.93 Q4.S@2 | 18.93,12.59 18.44,11.93 | 18.93,10.93 19.48,10.93 19.57,11.03 Q4.S@4 v19.46,11.25 | 18.93,10.93 Q4.S@1 | Q4.S@3 18.93,10.93 | Q3.D 18.6,13.02 | 18.6,13.02 18.6,12.84 | 18.6,12.84 18.6,12.34 | v16.28,12.33 v17.24,12.33 v18.2,12.33 | v18.5,11.25 18.53,11.29 L1.2 19.16,11.84 v19.16,12.33 | v18.2,13.29 18.47,13.02 18.6,13.02 | v19.16,13.29 18.71,12.84 18.6,12.84
  Top 0.6: C7.2 20.06,11.16 19.93,11.03 19.57,11.03
  Top 1: v15.2,12.33 v16.28,12.33 v17.24,12.33 Q3.D@1 v18.2,12.33 Q3.D@2 18.44,12.33 | Q4.S@3 18.72,11.34 18.6,11.34 18.6,12 19.26,12 19.26,11.28 19.26,12.18 18.93,12.18 18.93,12.59
  Bottom 0.3: 15.55,11.29 15.2,11.64 v15.2,12.33 | 15.55,11.29 14.88,10.62 14.82,10.56 14.46,10.2 10.98,10.2 10.68,10.51 10.68,10.62 U$1.P$21 | L1.2 15.55,11.29
TG1  (via drill 0.4 pad 0.8)
  Top 0.3: v20.34,24.46 20.34,22.68 19.79,22.13 19.57,22.13 Q1.G
  Bottom 0.3: U$1.P$14 8.68,17.61 9.47,18.4 9.47,19.06 9.82,19.41 9.82,22.54 11.75,24.46 v20.34,24.46
TG2  (via drill 0.4 pad 0.8)
  Top 0.3: v9.25,10.37 9.29,10.33 17.62,10.33 Q4.G
  Bottom 0.3: v9.25,10.37 9.25,10.55 9.18,10.62 U$1.P$24

### Text on the board
tNames: + | L+ | L- | -